# Altium project BLE_povodok_hv2.PrjPcb
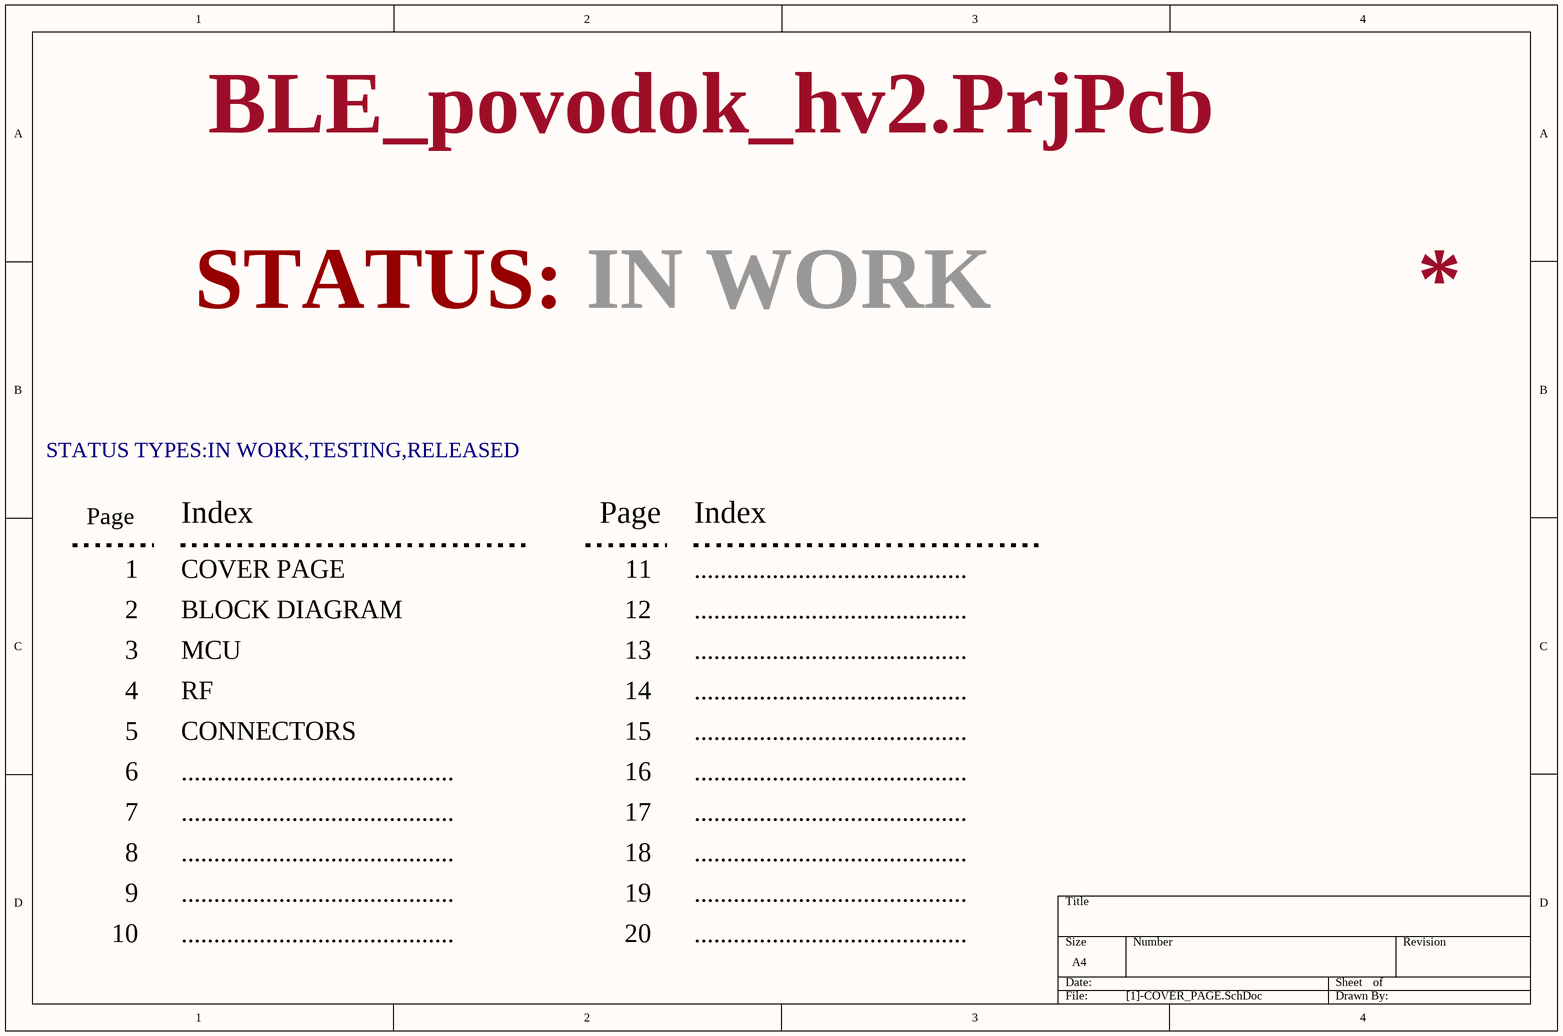
[diagram p0: [1]-COVER_PAGE.SchDoc]
5 sheets, 39 parts. Net scope: flat (ports and power ports of the same name join across sheets).
Board file: BLE_povodok_hv2.PcbDoc
Sheets:
  [1]-COVER_PAGE.SchDoc
  [2]-BLOCK_DIAGRAM.SchDoc
  [3]-MCU.SchDoc
  [4]-RF.SchDoc
  [5]-CONNECTORS.SchDoc

## Sheet [1]-COVER_PAGE.SchDoc
size A4

### Notes on the sheet
- STATUS:
- IN WORK
- STATUS TYPES:IN WORK,TESTING,RELEASED
- Page
- 1
- Index
- COVER PAGE
- 11
- ..........................................
- 2
- BLOCK DIAGRAM
- 12
- 3
- 4
- MCU
- RF
- 13
- 14
- 5
- 6
- CONNECTORS
- 15
- 16
- 7
- 17
- 8
- 9
- 18
- 19
- 10
- 20

## Sheet [2]-BLOCK_DIAGRAM.SchDoc
size A4
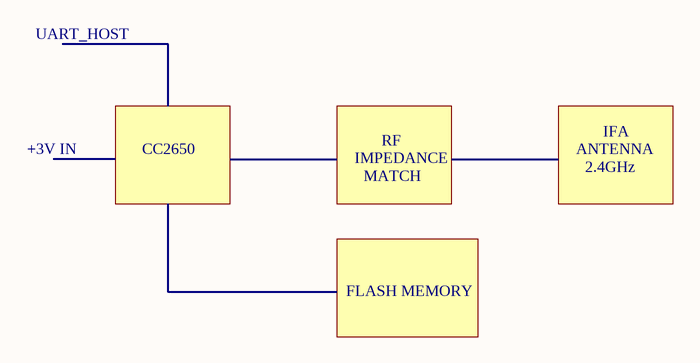
[diagram p1: [2]-BLOCK_DIAGRAM.SchDoc]

### Notes on the sheet
- UART_HOST
- +3V IN
- CC2650
- IMPEDANCE
- MATCH
- RF
- ANTENNA
- 2.4GHz
- IFA
- FLASH MEMORY

## Sheet [3]-MCU.SchDoc
size A4
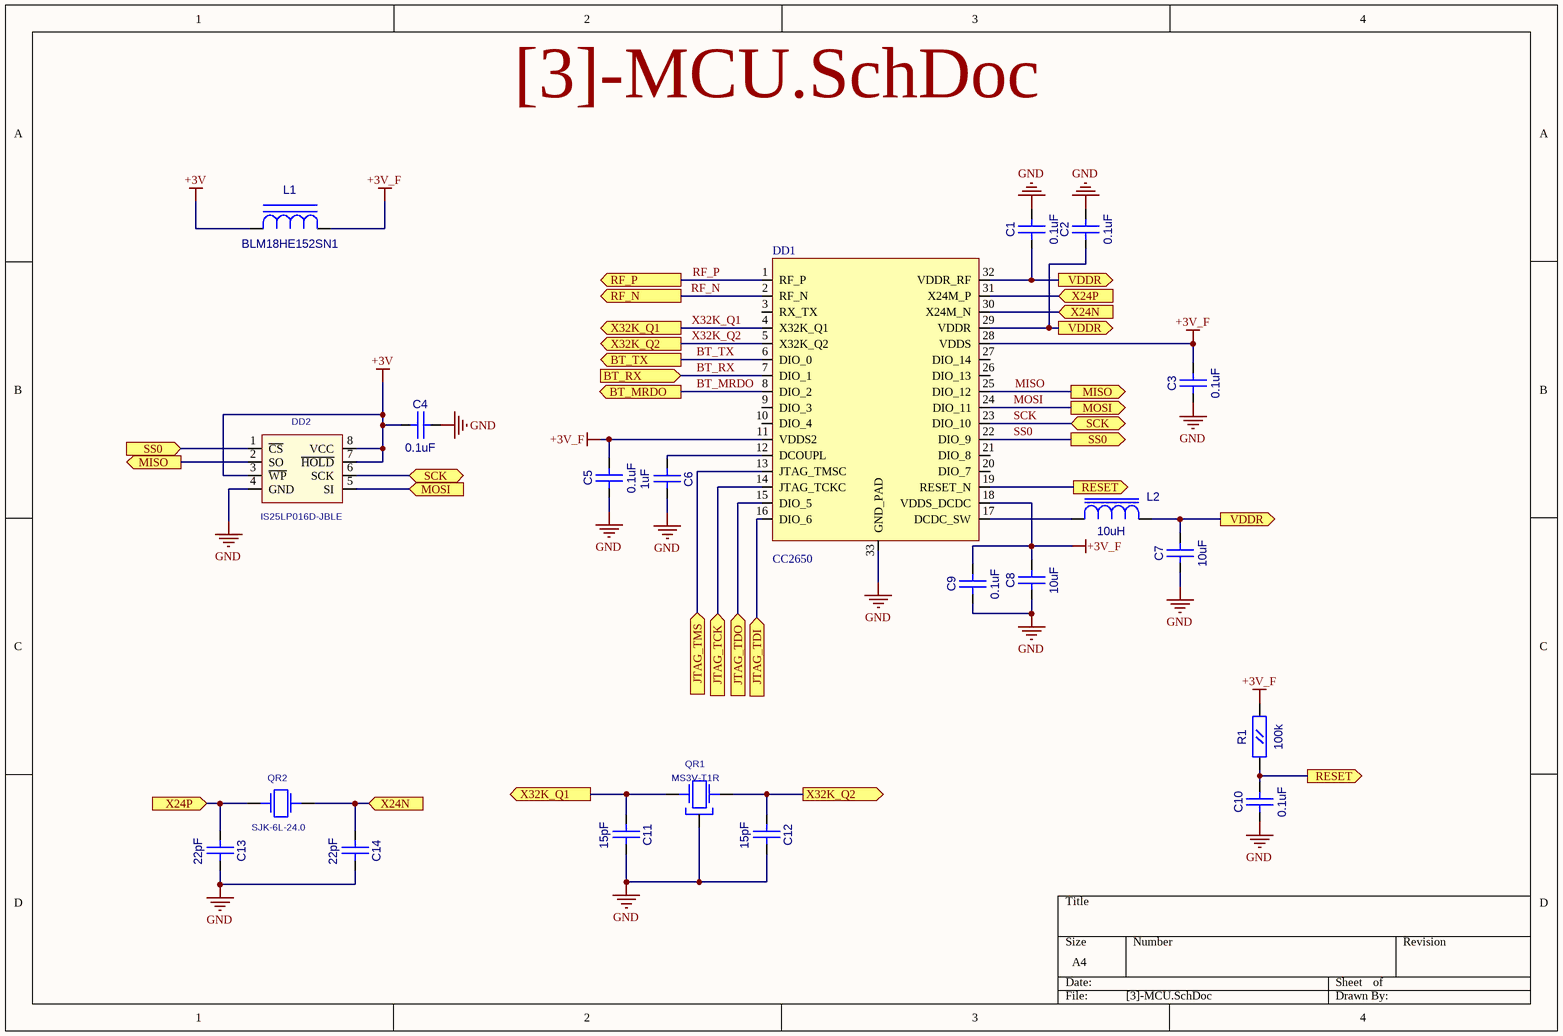
[diagram p2: [3]-MCU.SchDoc]

### Parts
C1  0.1uF  [CC0603]
C2  0.1uF  [CC0603]
C3  0.1uF  [CC0603]
C4  0.1uF  [CC0603]
C5  0.1uF  [CC0603]
C6  1uF  [CC0603]
C7  10uF  [CC0805]
C8  10uF  [CC0805]
C9  0.1uF  [CC0603]
C10  0.1uF  [CC0603]
C11  15pF  [CC0603]
C12  15pF  [CC0603]
C13  22pF  [CC0603]
C14  22pF  [CC0603]
DD1  CC2650  [QFN32_TI]
DD2  IS25LP016D-JBLE  [EIAJ_SO8]
L1  BLM18HE152SN1  [L0603]
L2  10uH  [RC0805]
QR1  MS3V-T1R  [MS3V-T1R]
QR2  SJK-6L-24.0  [AC5032_2]
R1  100k  [RC0603]

### Ports
BT_MRDO (out), BT_RX (in), BT_TX (out), JTAG_TCK (in), JTAG_TDI (in), JTAG_TDO (in), JTAG_TMS (in), MISO (out), MOSI (in), MOSI (out), RESET (out), RF_N (out), RF_P (out), SCK (bidir), SS0 (in), SS0 (out), VDDR (out), X24N (in), X24P (in), X32K_Q1 (out), X32K_Q2 (out)

### Nets
+3V: C4.1(A) DD2.3(~{WP}) DD2.7(~{HOLD}) DD2.8(VCC) L1.1(A)
+3V_F: C3.2(B) C5.2(B) C8.2(B) C9.2(B) DD1.11(VDDS2) DD1.18(VDDS_DCDC) DD1.28(VDDS) L1.2(C) R1.2(B)
GND: C1.2(B) C2.2(B) C3.1(A) C4.2(B) C5.1(A) C6.2(B) C7.1(A) C8.1(A) C9.1(A) C10.1(A) C11.2(B) C12.2(B) C13.2(B) C14.2(B) DD1.33(GND_PAD) DD2.4(GND) QR1.3
BT_MRDO: DD1.8(DIO_2) ; port BT_MRDO
BT_RX: DD1.7(DIO_1) ; port BT_RX
BT_TX: DD1.6(DIO_0) ; port BT_TX
JTAG_TCK: DD1.14(JTAG_TCKC) ; port JTAG_TCK
JTAG_TDI: DD1.16(DIO_6) ; port JTAG_TDI
JTAG_TDO: DD1.15(DIO_5) ; port JTAG_TDO
JTAG_TMS: DD1.13(JTAG_TMSC) ; port JTAG_TMS
MISO: DD1.25(DIO_12) DD2.2(SO) ; port MISO
MOSI: DD1.24(DIO_11) DD2.5(SI) ; port MOSI
RESET: C10.2(B) DD1.19(RESET_N) R1.1(A) ; port RESET
RF_N: DD1.2(RF_N) ; port RF_N
RF_P: DD1.1(RF_P) ; port RF_P
SCK: DD1.23(DIO_10) DD2.6(SCK) ; port SCK
SS0: DD1.22(DIO_9) DD2.1(~{CS}) ; port SS0
X32K_Q1: C11.1(A) DD1.4(X32K_Q1) QR1.2(X2) ; port X32K_Q1
X32K_Q2: C12.1(A) DD1.5(X32K_Q2) QR1.1(X1) ; port X32K_Q2
NetC1_1: C1.1(A) C2.1(A) C7.2(B) DD1.29(VDDR) DD1.32(VDDR_RF) L2.2(B) ; port VDDR
NetC6_1: C6.1(A) DD1.12(DCOUPL)
NetC13_1: C13.1(A) DD1.31(X24M_P) QR2.1 ; port X24P
NetC14_1: C14.1(A) DD1.30(X24M_N) QR2.2 ; port X24N
NetDD1_17: DD1.17(DCDC_SW) L2.1(A)

Not connected (* = marked no-connect by the designer): DD1 3(RX_TX) 9(DIO_3) 10(DIO_4) 20(DIO_7) 21(DIO_8) 26(DIO_13) 27(DIO_14)

### Library data of the parts
C1-C6 C9-C14 = CC0603
  C1-C5 C9 C10: Value: 0.1uF
  C6: Value: 1uF
  C11 C12: Value: 15pF
  C13 C14: Value: 22pF
C7 C8 = CC0805: Value: 10uF
DD1 = CC2650RHB: CC2650RHBT; Value: CC2650
DD2 = S25FL016A0LMFI01: Value: IS25LP016D-JBLE
L1 = L0603: Value: BLM18HE152SN1
L2 = L0805: Value: 10uH
QR1 = MS3V-T1R: CRYSTAL_32768 Hz; Value: *
QR2 = AC5032_2: AC5032/2; Value: SJK-6L-24.0
R1 = RC0603: Value: 100k

## Sheet [4]-RF.SchDoc
size A4
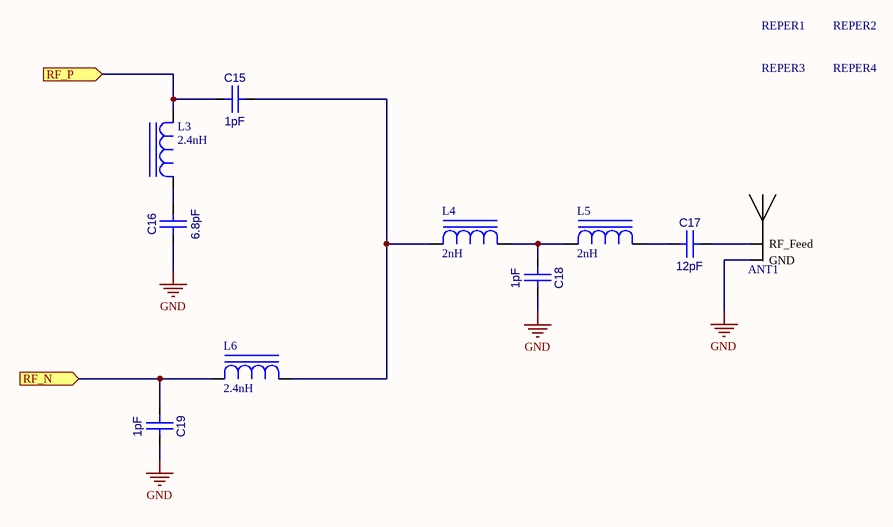
[diagram p3: [4]-RF.SchDoc]

### Parts
ANT1  IFA_TI_2.4G_Reference  [ANT_IFA_2.4G_BEST]  (value not drawn)
C15  1pF  [CC0603]
C16  6.8pF  [CC0603]
C17  12pF  [CC0603]
C18  1pF  [CC0603]
C19  1pF  [CC0603]
L3  2.4nH  [L0402]
L4  2nH  [L0402]
L5  2nH  [L0402]
L6  2.4nH  [L0402]
REPER1  REPER1.2  [REPER1.2]  (value not drawn)
REPER2  REPER1.2  [REPER1.2]  (value not drawn)
REPER3  REPER1.2  [REPER1.2]  (value not drawn)
REPER4  REPER1.2  [REPER1.2]  (value not drawn)

### Ports
RF_N (in), RF_P (in)

### Nets
GND: ANT1.2(GND) C16.1(A) C18.2(B) C19.2(B)
RF_N: C19.1(A) L6.1(A) ; port RF_N
RF_P: C15.1(A) L3.2(C) ; port RF_P
NetANT1_1: ANT1.1(RF_Feed) C17.2(B)
NetC15_2: C15.2(B) L4.1(A) L6.2(C)
NetC16_2: C16.2(B) L3.1(A)
NetC17_1: C17.1(A) L5.2(C)
NetC18_1: C18.1(A) L4.2(C) L5.1(A)

Not connected (* = marked no-connect by the designer): REPER1 1; REPER2 1; REPER3 1; REPER4 1

### Library data of the parts
ANT1 = ANT_WiFi_IFA_BEST: Value: IFA_TI_2.4G_Reference
C15-C19 = CC0603
  C15 C18 C19: Value: 1pF
  C16: Value: 6.8pF
  C17: Value: 12pF
L3-L6 = L0402
  L3 L6: Value: 2.4nH
  L4 L5: Value: 2nH
REPER1-REPER4 = REPER1.2: Value: *

## Sheet [5]-CONNECTORS.SchDoc
size A4
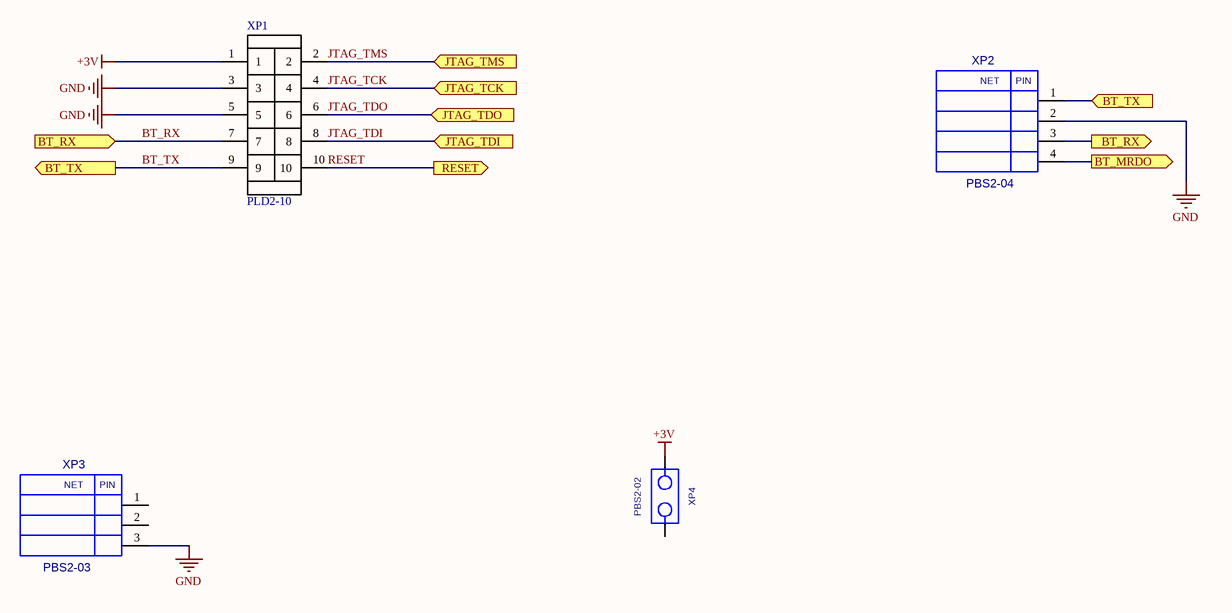
[diagram p4: [5]-CONNECTORS.SchDoc]

### Parts
XP1  PLD2-10  [PLD2-10]
XP2  PBS2-04  [PLS2-04]
XP3  PBS2-03  [PLS2-03]
XP4  PBS2-02  [PLS2-02]

### Ports
BT_MRDO (out), BT_RX (in), BT_RX (out), BT_TX (in), BT_TX (out), JTAG_TCK (in), JTAG_TDI (in), JTAG_TDO (in), JTAG_TMS (in), RESET (out)

### Nets
+3V: XP1.1 XP4.1
GND: XP1.3 XP1.5 XP2.2 XP3.3
BT_MRDO: XP2.4 ; port BT_MRDO
BT_RX: XP1.7 XP2.3 ; port BT_RX
BT_TX: XP1.9 XP2.1 ; port BT_TX
JTAG_TCK: XP1.4 ; port JTAG_TCK
JTAG_TDI: XP1.8 ; port JTAG_TDI
JTAG_TDO: XP1.6 ; port JTAG_TDO
JTAG_TMS: XP1.2 ; port JTAG_TMS
RESET: XP1.10 ; port RESET

Not connected (* = marked no-connect by the designer): XP3 1 2; XP4 2

### Notes on the sheet
- (in symbol PLS2-03) NET; PIN
- (in symbol PLS2-04) NET; PIN

### Library data of the parts
XP2 = PLS2-04: Value: *
XP3 = PLS2-03: Value: *
XP4 = PLS2-02: Value: *
XP1 = PLD2-10: Value: PLD2-10

## Nets that join several sheets
+3V: [3]-MCU (5 pins), [5]-CONNECTORS (XP1.1 XP4.1)
GND: [3]-MCU (17 pins), [4]-RF (ANT1.2 C16.1 C18.2 C19.2), [5]-CONNECTORS (XP1.3 XP1.5 XP2.2 XP3.3)
BT_MRDO: [3]-MCU (DD1.8), [5]-CONNECTORS (XP2.4)
BT_RX: [3]-MCU (DD1.7), [5]-CONNECTORS (XP1.7 XP2.3)
BT_TX: [3]-MCU (DD1.6), [5]-CONNECTORS (XP1.9 XP2.1)
JTAG_TCK: [3]-MCU (DD1.14), [5]-CONNECTORS (XP1.4)
JTAG_TDI: [3]-MCU (DD1.16), [5]-CONNECTORS (XP1.8)
JTAG_TDO: [3]-MCU (DD1.15), [5]-CONNECTORS (XP1.6)
JTAG_TMS: [3]-MCU (DD1.13), [5]-CONNECTORS (XP1.2)
RESET: [3]-MCU (C10.2 DD1.19 R1.1), [5]-CONNECTORS (XP1.10)
RF_N: [3]-MCU (DD1.2), [4]-RF (C19.1 L6.1)
RF_P: [3]-MCU (DD1.1), [4]-RF (C15.1 L3.2)